# EAGLE design main_v3 (EAGLE 8.5.1)

## Sheet 1 of 5: Main Control ICs
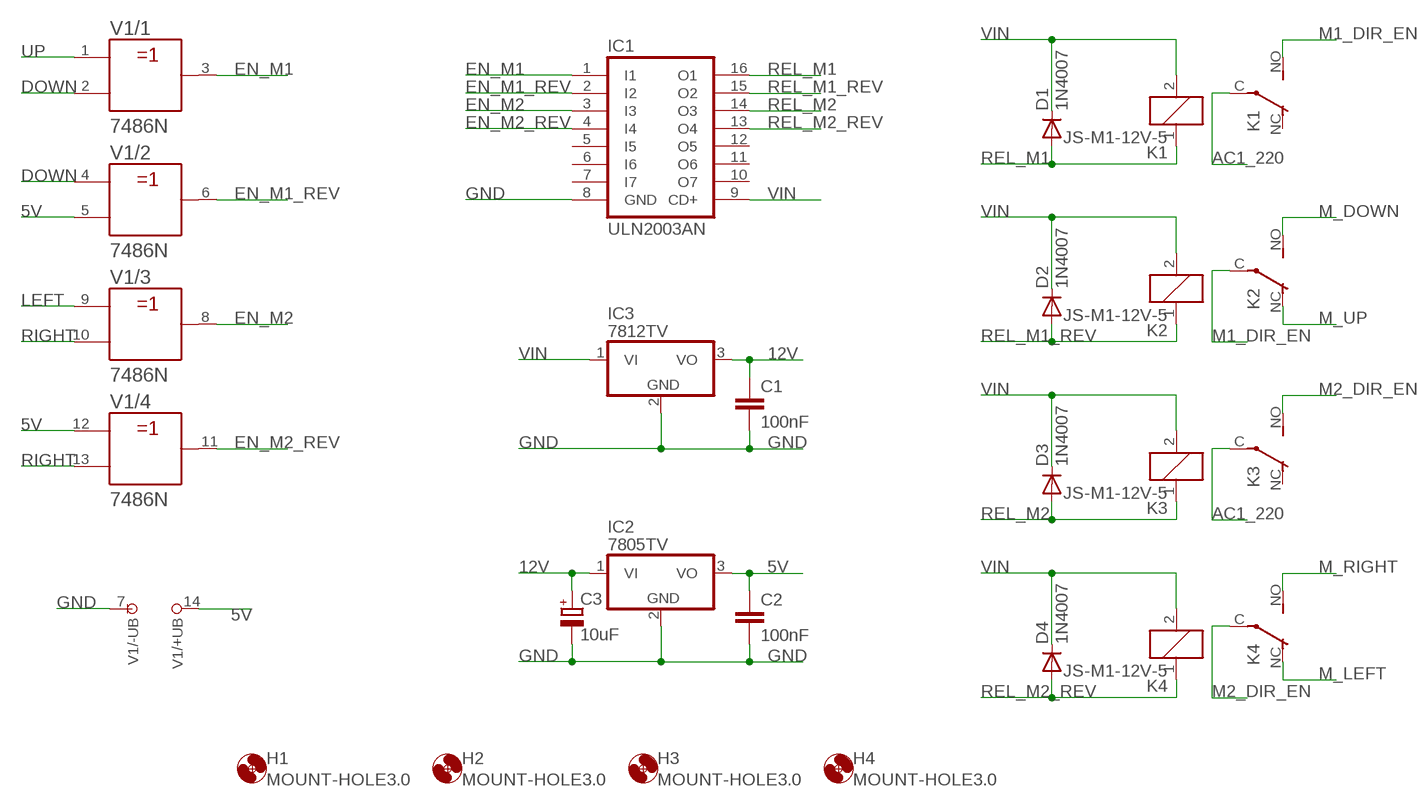
[diagram p0: schematic, sheet 1]

### Parts
C1  100nF  C-EU050-025X075  [C050-025X075]
C2  100nF  C-EU050-025X075  [C050-025X075]
C3  10uF  CPOL-EUE3.5-8  [E3,5-8]
D1  1N4007  1N4004  [DO41-10]
D2  1N4007  1N4004  [DO41-10]
D3  1N4007  1N4004  [DO41-10]
D4  1N4007  1N4004  [DO41-10]
H1  MOUNT-HOLE3.0  [3,0]
H2  MOUNT-HOLE3.0  [3,0]
H3  MOUNT-HOLE3.0  [3,0]
H4  MOUNT-HOLE3.0  [3,0]
IC1  ULN2003AN  [DIL16]
IC2  7805TV  [TO220V]
IC3  7812TV  [TO220V]
K1  JS-M1-12V-5  [JS-M]
K2  JS-M1-12V-5  [JS-M]
K3  JS-M1-12V-5  [JS-M]
K4  JS-M1-12V-5  [JS-M]
V1  7486N  [DIL14]

### Nets
5V: C2.1 IC2.3(VO) V1.5(/2:B) V1.12(/4:A) V1.14(/+UB:+UB) ; also sheet 2
12V: C1.1 C3.+ IC2.1(VI) IC3.3(VO)
AC1_220: K1.C(2:P) K3.C(2:P) ; also sheet 3
DOWN: V1.2(/1:B) V1.4(/2:A) ; also sheet 2
EN_M1: IC1.1(I1) V1.3(/1:Y)
EN_M1_REV: IC1.2(I2) V1.6(/2:Y)
EN_M2: IC1.3(I3) V1.8(/3:Y)
EN_M2_REV: IC1.4(I4) V1.11(/4:Y)
GND: C1.2 C2.2 C3.- IC1.8(GND) IC2.2(GND) IC3.2(GND) V1.7(/-UB:-UB) ; also sheet 2,4
LEFT: V1.9(/3:A) ; also sheet 2
M1_DIR_EN: K1.NO(2:S) K2.C(2:P)
M2_DIR_EN: K3.NO(2:S) K4.C(2:P)
M_DOWN: K2.NO(2:S) ; also sheet 3
M_LEFT: K4.NC(2:O) ; also sheet 3
M_RIGHT: K4.NO(2:S) ; also sheet 3
M_UP: K2.NC(2:O) ; also sheet 3
REL_M1: D1.A IC1.16(O1) K1.1 ; also sheet 5
REL_M1_REV: D2.A IC1.15(O2) K2.1 ; also sheet 5
REL_M2: D3.A IC1.14(O3) K3.1 ; also sheet 5
REL_M2_REV: D4.A IC1.13(O4) K4.1 ; also sheet 5
RIGHT: V1.10(/3:B) V1.13(/4:B) ; also sheet 2
UP: V1.1(/1:A) ; also sheet 2
VIN: D1.C D2.C D3.C D4.C IC1.9(CD+) IC3.1(VI) K1.2 K2.2 K3.2 K4.2 ; also sheet 2,4,5
Unconnected: IC1.5(I5) IC1.6(I6) IC1.7(I7) IC1.10(O7) IC1.11(O6) IC1.12(O5) K1.NC(2:O) K3.NC(2:O)

## Sheet 2 of 5: Inputs
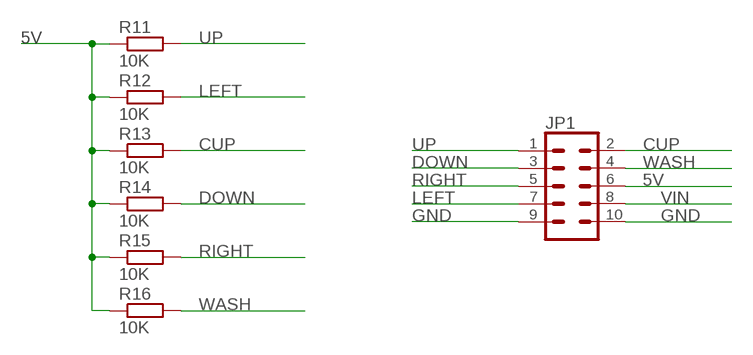
[diagram p1: schematic, sheet 2]

### Parts
JP1  CONN_05X2PTH  [2X5]
R11  10K  R-EU_0207/10  [0207/10]
R12  10K  R-EU_0207/10  [0207/10]
R13  10K  R-EU_0207/10  [0207/10]
R14  10K  R-EU_0207/10  [0207/10]
R15  10K  R-EU_0207/10  [0207/10]
R16  10K  R-EU_0207/10  [0207/10]

### Nets
5V: JP1.6 R11.1 R12.1 R13.1 R14.1 R15.1 R16.1 ; also sheet 1
CUP: JP1.2 R13.2
DOWN: JP1.3 R14.2 ; also sheet 1
GND: JP1.9 JP1.10 ; also sheet 1,4
LEFT: JP1.7 R12.2 ; also sheet 1
RIGHT: JP1.5 R15.2 ; also sheet 1
UP: JP1.1 R11.2 ; also sheet 1
VIN: JP1.8 ; also sheet 1,4,5
WASH: JP1.4 R16.2

## Sheet 3 of 5: Terminals
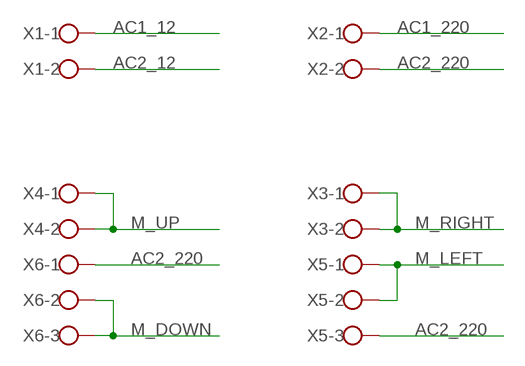
[diagram p2: schematic, sheet 3]

### Parts
X1  W237-102  [W237-102]
X2  W237-102  [W237-102]
X3  W237-102  [W237-102]
X4  W237-102  [W237-102]
X5  W237-103  [W237-103]
X6  W237-103  [W237-103]

### Nets
AC1_12: X1.1 ; also sheet 4
AC1_220: X2.1 ; also sheet 1
AC2_12: X1.2 ; also sheet 4
AC2_220: X2.2 X5.3 X6.1
M_DOWN: X6.2 X6.3 ; also sheet 1
M_LEFT: X5.1 X5.2 ; also sheet 1
M_RIGHT: X3.1 X3.2 ; also sheet 1
M_UP: X4.1 X4.2 ; also sheet 1

## Sheet 4 of 5: Bridge Rectifir
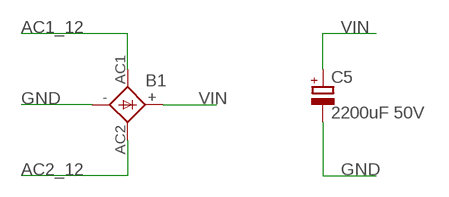
[diagram p3: schematic, sheet 4]

### Parts
B1  GBPC6  [GBPC6]
C5  2200uF 50V  CPOL-EUE7.5-18  [E7,5-18]

### Nets
AC1_12: B1.AC1 ; also sheet 3
AC2_12: B1.AC2 ; also sheet 3
GND: B1.- C5.- ; also sheet 1,2
VIN: B1.+ C5.+ ; also sheet 1,2,5

## Sheet 5 of 5: Indicators
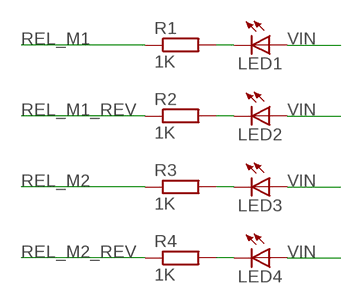
[diagram p4: schematic, sheet 5]

### Parts
LED1  LED5MM  [LED5MM]
LED2  LED5MM  [LED5MM]
LED3  LED5MM  [LED5MM]
LED4  LED5MM  [LED5MM]
R1  1K  R-EU_0207/10  [0207/10]
R2  1K  R-EU_0207/10  [0207/10]
R3  1K  R-EU_0207/10  [0207/10]
R4  1K  R-EU_0207/10  [0207/10]

### Nets
N$1: LED1.K(C) R1.2
N$2: LED2.K(C) R2.2
N$3: LED3.K(C) R3.2
N$4: LED4.K(C) R4.2
REL_M1: R1.1 ; also sheet 1
REL_M1_REV: R2.1 ; also sheet 1
REL_M2: R3.1 ; also sheet 1
REL_M2_REV: R4.1 ; also sheet 1
VIN: LED1.A LED2.A LED3.A LED4.A ; also sheet 1,2,4

## Library data of the parts
B1 = rectifier:GBPC6: GENERAL INSTRUMENT RECTIFIER
C1 C2 = rcl:C-EU: CAPACITOR, European symbol; SPICEPREFIX: C
C3 = rcl:CPOL-EU: POLARIZED CAPACITOR, European symbol; SPICEPREFIX: C
C5 = rcl:CPOL-EU: POLARIZED CAPACITOR, European symbol
D1-D4 = adafruit:1N4004: DIODE General purpose 1N400x type rectifier (With bigger pads) http://www.ladyada.net/library/pcb/eaglelibrary.html
H1-H4 = holes:MOUNT-HOLE: MOUNTING HOLE with drill center marker
IC1 = uln-udn:ULN2003A: DRIVER ARRAY
IC2 IC3 = linear:78*: Positive VOLTAGE REGULATOR Source: http://cache.national.com/ds/LM/LM78L05.pdf http://www.fairchildsemi.com/ds/LM/LM7805.pdf
JP1 = SparkFun-Connectors:CONN_05X2: Multi connection point. Often used as Generic Header-pin footprint for 0.1 inch spaced/style header connections For AVR SPI programming port, see special device with nice symbol: "AVR_SPI_PROG_5x2.dev" You can populate with any combo of single row headers, but if you'd like an exact match, check these: 2x5 AVR ICSP Male Header <https://www.sparkfun.com/products/778> (PRT-00778) 2x5 Pin Shrouded Header <https://www.sparkfun.com/products/8506> (PRT-08506) On any of the 0.1 inch spaced packages, you can populate with these: Break Away Headers - Straight <https://www.sparkfun.com/products/116> (PRT-00116) Break Away Male Headers - Right Angle <https://www.sparkfun.com/products/553> (PRT-00553) Female Headers <https://www.sparkfun.com/products/115> (PRT-00115) Break Away Headers - Machine Pin <https://www.sparkfun.com/products/117> (PRT-00117) Break Away Female Headers - Swiss Machine Pin <https://www.sparkfun.com/products/743> (PRT-00743) Special note: the shrouded connector mates well with our 5x2 ribbon cables: 2x5 Pin IDC Ribbon Cable <https://www.sparkfun.com/products/8535> (PRT-08535); PROD_ID: CONN-08499; SF_ID: PRT-0778
K1-K4 = relay:JS-M1*: Automotive Ultra-Miniature Power Relay NAiS Source: http://www.mew-europe.com/.. en_ds_61211_0000.pdf; MF: FARNELL; MPN: JSM1-12V-5; OC_FARNELL: 910351; OC_NEWARK: 14J1764
LED1-LED4 = adafruit:LED: LED OSRAM: - CHIPLED LG R971, LG N971, LY N971, LG Q971, LY Q971, LO R971, LY R971 LH N974, LH R974 LS Q976, LO Q976, LY Q976 LO Q996 - Hyper CHIPLED LW Q18S LB Q993, LB Q99A, LB R99A - SideLED LS A670, LO A670, LY A670, LG A670, LP A670 LB A673, LV A673, LT A673, LW A673 LH A674 LY A675 LS A676, LA A676, LO A676, LY A676, LW A676 LS A679, LY A679, LG A679 - Hyper Micro SIDELED® LS Y876, LA Y876, LO Y876, LY Y876 LT Y87S - SmartLED LW L88C, LW L88S LB L89C, LB L89S, LG L890 LS L89K, LO L89K, LY L89K LS L896, LA L896, LO L896, LY L896 - TOPLED LS T670, LO T670, LY T670, LG T670, LP T670 LSG T670, LSP T670, LSY T670, LOP T670, LYG T670 LG T671, LOG T671, LSG T671 LB T673, LV T673, LT T673, LW T673 LH T674 LS T676, LA T676, LO T676, LY T676, LB T676, LH T676, LSB T676, LW T676 LB T67C, LV T67C, LT T67C, LS T67K, LO T67K, LY T67K, LW E67C LS E67B, LA E67B, LO E67B, LY E67B, LB E67C, LV E67C, LT E67C LW T67C LS T679, LY T679, LG T679 LS T770, LO T770, LY T770, LG T770, LP T770 LB T773, LV T773, LT T773, LW T773 LH T774 LS E675, LA E675, LY E675, LS T675 LS T776, LA T776, LO T776, LY T776, LB T776 LHGB T686 LT T68C, LB T68C - Hyper Mini TOPLED® LB M676 - Mini TOPLED Santana® LG M470 LS M47K, LO M47K, LY M47K Source: http://www.osram.convergy.de/
R1-R4 R11-R16 = rcl:R-EU_: RESISTOR, European symbol; SPICEPREFIX: R
V1 = 74ttl-din:74*86: Quad 2-input EXCLUSIV-OR gate
X1-X4 = con-wago-500:W237-102: WAGO SCREW CLAMP
X5 X6 = con-wago-500:W237-103: WAGO SCREW CLAMP

## Board
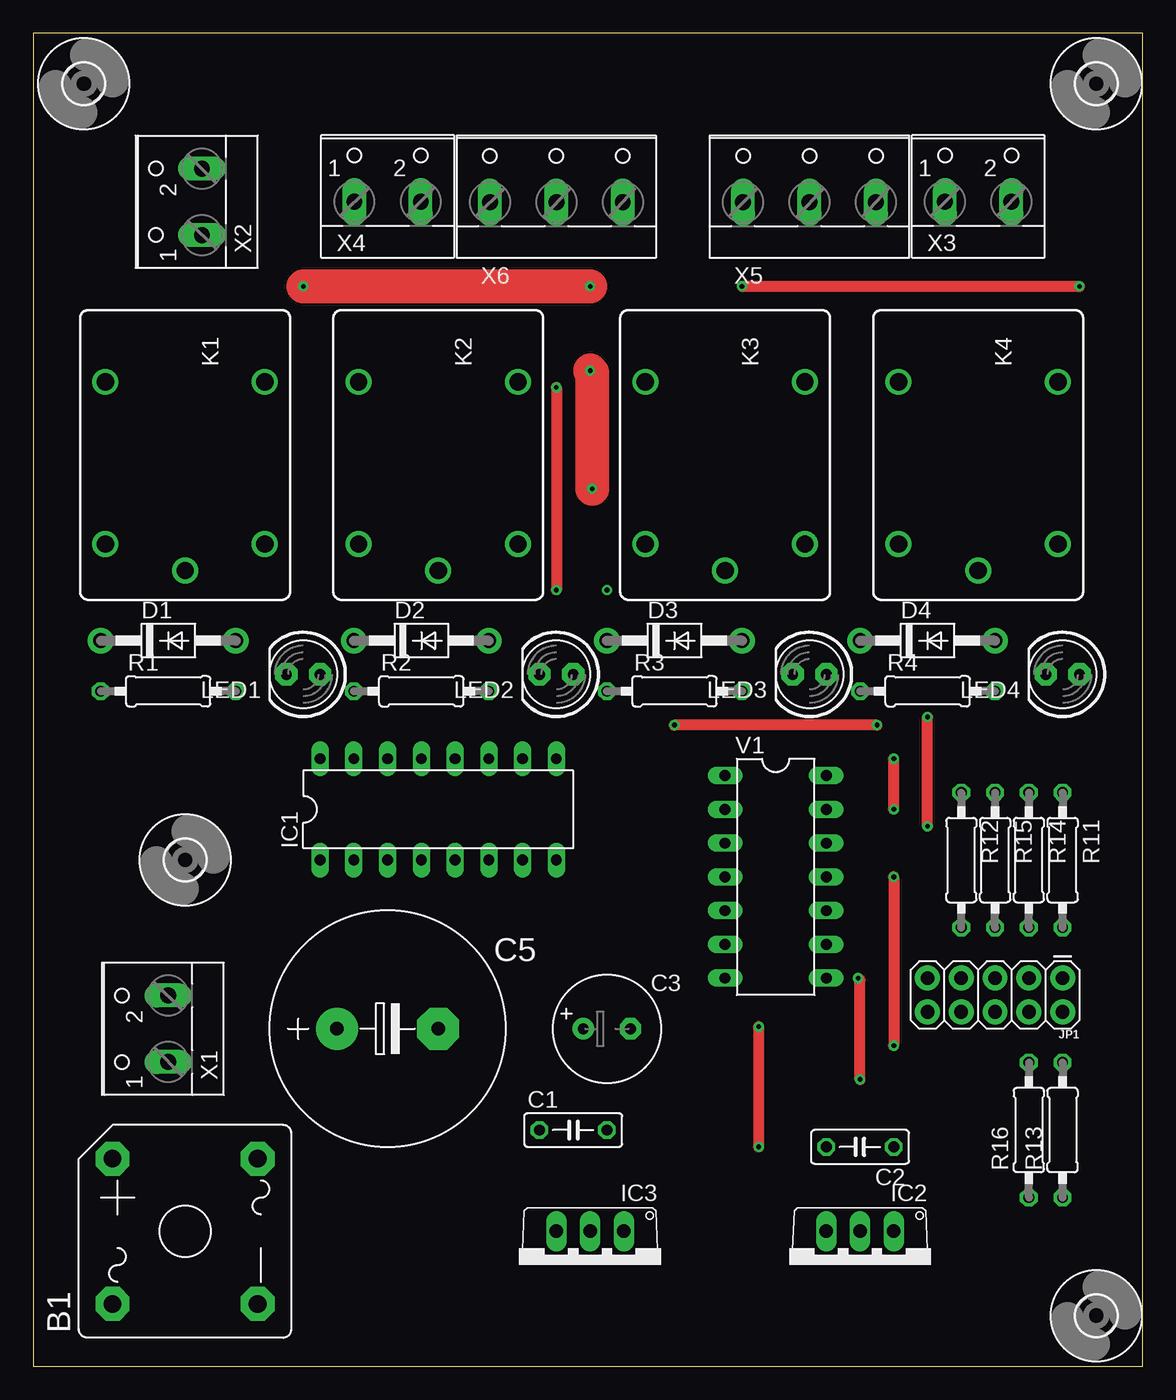
[diagram p5: board, top side]
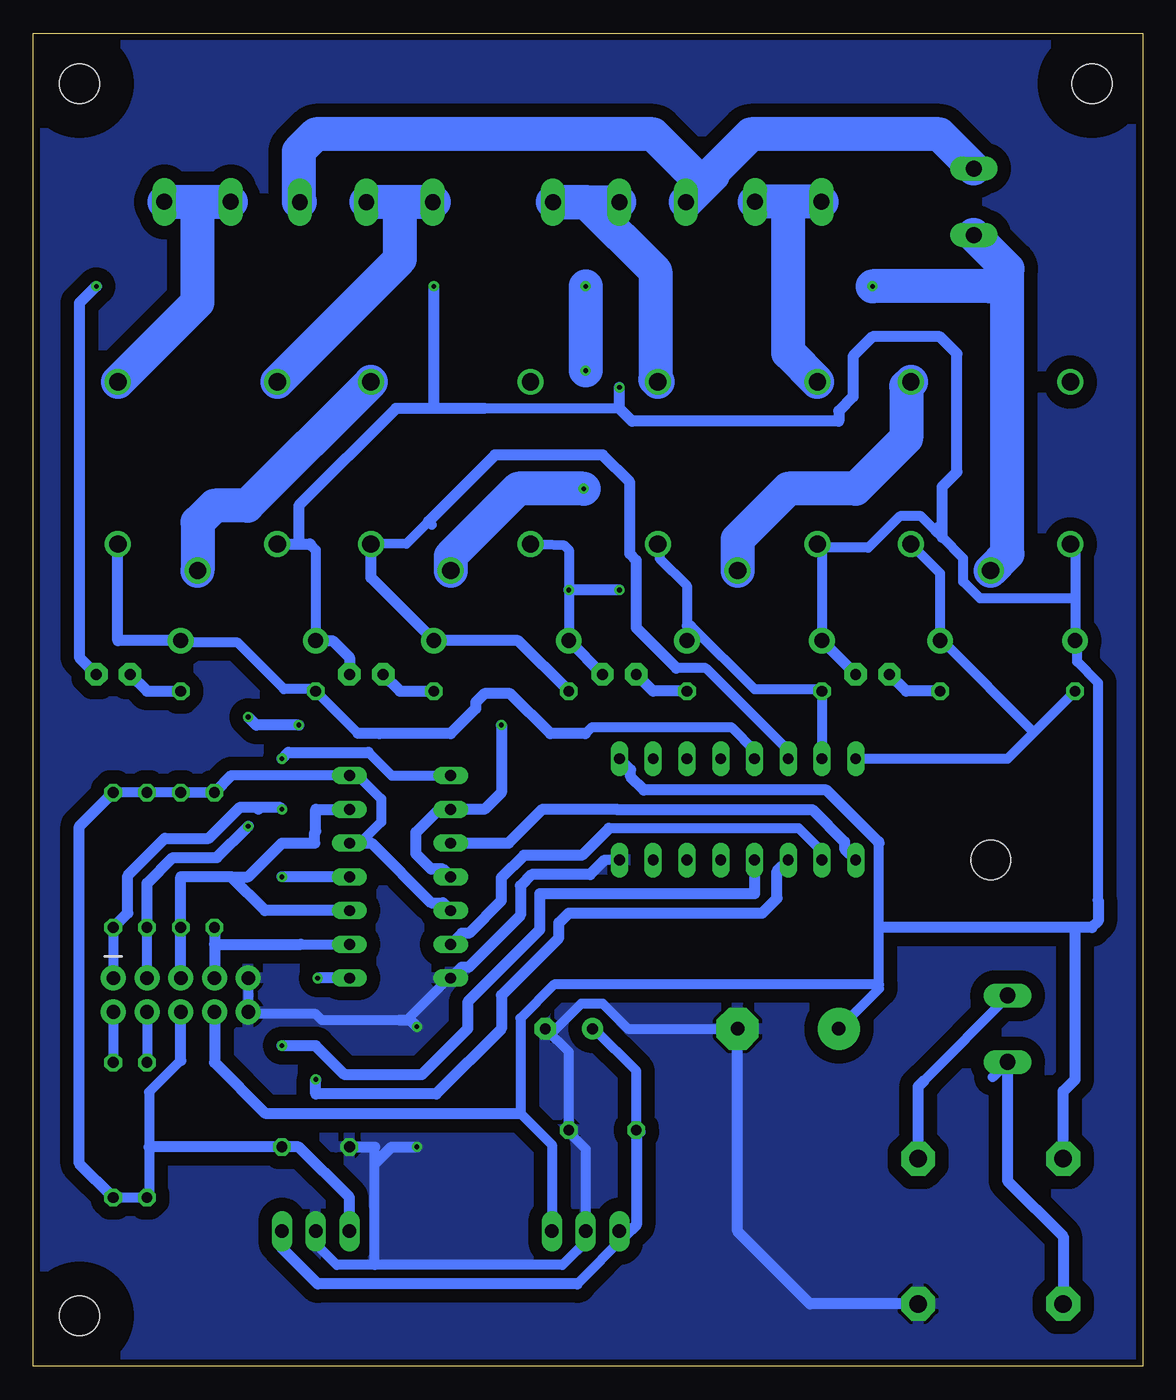
[diagram p6: board, bottom side, seen from below]

Size 83.49 x 100.32 mm. Coordinates in mm from the lower left corner, seen from the top.
Outline: 0,0 83.49,0 83.49,100.32 0,100.32 0,0
Copper layers (1*16): Top 0.035mm / dielectric 1.5mm / Bottom 0.035mm
Design rules "default *": minimum track width 30mil, minimum drill 0.35mm, track to track 40mil, track to pad 40mil, pad to pad 6mil, via to via 6mil, smd to smd 6mil, copper to edge 20mil, drill to drill 6mil, minimum pad ring 10mil, minimum via ring 8mil, stop-mask expansion 4mil, vias tented up to drill 0mil, thermal gap 10mil

### Footprints (pad centres in the part's own frame; a part is rotated, then mirrored left to right if it is on the bottom)
GBPC6 = drill 1.321 pad 2.54 octagon: + 5.461,5.461; - -5.461,-5.461; AC1 -5.461,5.461; AC2 5.461,-5.461
C050-025X075 = drill 0.813 octagon: 1 -2.54,0; 2 2.54,0
E3,5-8 = drill 0.813 pad 1.6: + -1.778,0 | drill 0.813 pad 1.6 octagon: - 1.778,0
E7,5-18 = drill 1.016 pad 3.15: + -3.81,0 | drill 1.016 pad 3.15 octagon: - 3.81,0
DO41-10 = drill 1.118 pad 1.93: A 5.08,0; C -5.08,0
3,0 = hole 3: 0,0
DIL16 = drill 0.813 long: 1 -8.89,-3.81; 2 -6.35,-3.81; 3 -3.81,-3.81; 4 -1.27,-3.81; 5 1.27,-3.81; 6 3.81,-3.81; 7 6.35,-3.81; 8 8.89,-3.81; 9 8.89,3.81; 10 6.35,3.81; 11 3.81,3.81; 12 1.27,3.81; 13 -1.27,3.81; 14 -3.81,3.81; 15 -6.35,3.81; 16 -8.89,3.81
TO220V = drill 1.016 long: 1 -2.54,-2.54; 2 0,-2.54; 3 2.54,-2.54
2X5 = drill 1.016 pad 1.88: 1 0,0; 2 0,2.54; 3 2.54,0; 4 2.54,2.54; 5 5.08,0; 6 5.08,2.54; 7 7.62,0; 8 7.62,2.54; 9 10.16,0; 10 10.16,2.54
JS-M = drill 1.3: 1 6.7,6; 2 6.7,-6; C 8.7,0; NC -5.5,-6; NO -5.5,6
LED5MM = drill 0.813 pad 1.676 octagon: A -1.27,0; K 1.27,0
0207/10 = drill 0.813 octagon: 1 -5.08,0; 2 5.08,0
DIL14 = drill 0.813 long: 1 -7.62,-3.81; 2 -5.08,-3.81; 3 -2.54,-3.81; 4 0,-3.81; 5 2.54,-3.81; 6 5.08,-3.81; 7 7.62,-3.81; 8 7.62,3.81; 9 5.08,3.81; 10 2.54,3.81; 11 0,3.81; 12 -2.54,3.81; 13 -5.08,3.81; 14 -7.62,3.81
W237-102 = drill 1.194 long: 1 -2.5,-1.27; 2 2.5,-1.27
W237-103 = drill 1.194 long: 1 -5,-1.29; 2 0,-1.29; 3 5,-1.29

### Placement (x,y rotation side)
B1  11.43,10.16 90 top
C1  40.64,17.78 0 top
C2  62.23,16.51 180 top
C3  43.18,25.4 0 top
C5  26.67,25.4 0 top
D1  10.16,54.61 0 top
D2  29.21,54.61 0 top
D3  48.26,54.61 0 top
D4  67.31,54.61 0 top
H1  80.01,3.81 0 top
H2  80.01,96.52 0 top
H3  11.43,38.1 0 top
H4  3.81,96.52 0 top
IC1  30.48,41.91 0 top
IC2  62.23,7.62 180 top
IC3  41.91,7.62 180 top
JP1  77.47,29.21 180 top
K1  11.43,68.58 270 top
K2  30.48,68.58 270 top
K3  52.07,68.58 270 top
K4  71.12,68.58 270 top
LED1  20.32,52.07 180 top
LED2  39.37,52.07 180 top
LED3  58.42,52.07 180 top
LED4  77.47,52.07 180 top
R1  10.16,50.8 0 top
R2  29.21,50.8 0 top
R3  48.26,50.8 0 top
R4  67.31,50.8 0 top
R11  77.47,38.1 270 top
R12  69.85,38.1 270 top
R13  77.47,17.78 90 top
R14  74.93,38.1 270 top
R15  72.39,38.1 270 top
R16  74.93,17.78 90 top
V1  55.88,36.83 270 top
X1  8.89,25.4 90 top
X2  11.43,87.63 90 top
X3  71.12,88.9 0 top
X4  26.67,88.9 0 top
X5  58.42,88.9 0 top
X6  39.37,88.9 0 top

### Tracks (layer width: path | path; a pad name or v marks a point on that pad's centre or on a via)
5V
  Bottom 0.762: 68.58,44.45 V1.14 59.37,44.29 58.9,44.29 57.31,42.7 57.31,40.96 58.74,39.53 V1.12 | R15.1 R12.1 R14.1 R11.1 | R13.1 R16.1 74.77,13.02 74.77,16.51 74.77,20.64 72.39,23.02 | 51.44,34.29 V1.5
  Bottom 0.813: 68.58,44.45 R12.1 | R13.1 80.01,15.24 80.01,40.64 R11.1 | V1.5 52.65,34.87 53.54,34.87 58.04,39.37 V1.12 | IC2.3 59.69,12.7 63.5,16.51 C2.1 74.77,16.51 | 72.39,23.02 JP1.6
12V
  Bottom 0.762: C3.+ 41.27,25.4 38.1,22.22 C1.1 37.78,17.62 | 42.55,6.19 38.97,9.76 38.89,9.84 IC3.3
  Bottom 0.813: 42.55,6.19 62.07,6.19 64.77,8.89 IC2.1 | C1.1 38.1,10.64 38.97,9.76
AC1_12
  Bottom 0.762: 11.27,21.75 10.16,22.86 X1.1
  Bottom 0.813: X1.1 10.16,13.97 5.97,9.78 B1.AC1
AC1_220  (via drill 0.35)
  Top 2.54: v20.32,81.28 v41.91,81.28 | v41.91,74.93 42.06,74.77 v42.06,66.04
  Bottom 2.54: K1.C 10.16,61.15 10.16,82.59 | 10.16,82.59 X2.1 | 10.16,82.59 11.47,81.28 v20.32,81.28 | v41.91,81.28 v41.91,74.93 | v42.06,66.04 46.99,66.04 52.07,60.96 K3.C
AC2_12
  Bottom 0.762: 16.43,21.51 10.16,27.78 X1.2
  Bottom 0.813: B1.AC2 16.89,21.05 16.43,21.51
AC2_220
  Bottom 2.54: X2.2 15.28,92.71 29.48,92.71 32.35,89.84 32.35,89.63 33.05,88.93 | 33.05,88.93 X6.1 | 33.05,88.93 36.83,92.71 62.23,92.71 63.5,91.44 63.5,87.63 63.48,87.61 X5.3
CUP
  Bottom 0.762: JP1.2 R13.2
DOWN  (via drill 0.35)
  Top 0.813: v67.31,40.64 v67.31,48.86 | v63.5,48.26 v48.26,48.26
  Bottom 0.762: V1.2 51.44,41.91 | JP1.3 R14.2
  Bottom 0.813: v63.5,48.26 66.71,48.26 v67.31,48.86 | R14.2 74.93,36.34 72.99,38.28 69.67,38.28 v67.31,40.64 | v48.26,48.26 48.26,43.18 49.53,41.91 V1.2 52.96,41.91 54.69,40.18 54.69,38.56 53.54,37.41 52.65,37.41 V1.4
EN_M1
  Bottom 0.813: V1.3 47.7,39.37 45.14,41.93 39.56,41.93 39.54,41.9 24.87,41.9 22.43,39.47 22.43,38.94 IC1.1
EN_M1_REV
  Bottom 0.762: 40.16,40.48 25.88,40.48 24.13,38.74 IC1.2
  Bottom 0.813: V1.6 51.23,32.59 50.7,32.59 48.27,35.03 48.27,36.76 46.57,38.46 42.19,38.46 40.16,40.48
EN_M2  (via drill 0.35)
  Top 0.813: v62.23,21.59 62.23,29.06 v62.08,29.21
  Bottom 0.813: V1.8 v62.08,29.21 | IC1.3 27.51,37.26 27.51,35.21 28.61,34.11 43.18,34.11 43.92,33.37 43.92,32.24 48.25,27.91 48.25,25.41 53.16,20.5 62.23,20.5 v62.23,21.59
EN_M2_REV  (via drill 0.35)
  Top 0.813: v64.77,36.83 v64.77,24.13
  Bottom 0.813: V1.11 v64.77,36.83 | IC1.4 29.21,35.56 45.37,35.56 45.37,32.84 50.8,27.41 50.8,25.4 54.25,21.95 60.05,21.95 62.23,24.13 v64.77,24.13
GND  (via drill 0.35)
  Top 0.813: v54.61,16.51 v54.61,25.55
  Bottom 0.762: JP1.9 JP1.10 66.99,26.51 62.23,26.51 61.75,26.04 55.88,26.04 55.4,26.04 52.39,29.05 V1.7 | IC1.8 40.48,38.1 | C5.- 38.73,25.4 40.64,27.3 42.23,27.3 44.29,25.24 C3.- 44.93,25.4 43.18,23.65 C1.2 43.02,17.46 41.91,16.35 IC3.2 42.07,9.84 42.07,9.21 43.66,7.62 57.78,7.62 | 62.07,9.05 60.64,7.62 57.78,7.62 | 57.78,7.62 57.78,15.24 57.78,16.51
  Bottom 0.813: V1.7 51.23,30.05 50.7,30.05 46.82,33.93 46.82,36.16 45.97,37.01 41.57,37.01 40.48,38.1 | IC2.2 62.07,10 62.07,9.05 | C2.2 57.78,16.51 | 57.78,15.24 56.52,16.51 v54.61,16.51 | v54.61,25.55 55.09,26.04 55.88,26.04 | B1.- 25.02,4.7 30.48,10.16 C5.-
  pour Bottom: 0,100.33 83.82,100.33 83.82,0 0,0
LEFT
  Bottom 0.762: 63.34,31.75 V1.9
  Bottom 0.813: R12.2 69.85,31.75 | 69.85,31.75 JP1.7 | 69.85,31.75 63.34,31.75
M1_DIR_EN
  Bottom 0.762: 30.48,60.96 K2.C | 17.46,73.98 K1.NO
  Bottom 2.54: K1.NO 17.78,73.73 17.78,69.85 21.59,66.04 26.67,66.04 30.48,62.23 K2.C
M2_DIR_EN
  Bottom 2.54: K3.NO 67.38,64.77 69.85,64.77 71.12,63.5 K4.C
M_DOWN
  Bottom 2.54: K2.NO 36.68,74.28 36.68,82.4 41.91,87.63 44.35,87.63 | 44.35,87.63 X6.3 | 44.35,87.63 44.33,87.61 X6.2
M_LEFT
  Bottom 0.813: 58.4,87.63 55.88,87.63 53.4,87.63 | 53.34,87.63 53.4,87.63 | 53.4,87.63 X5.1
  Bottom 2.54: K4.NC 55.88,83.32 55.88,87.63 | X5.2 58.4,87.63 53.34,87.63
M_RIGHT
  Bottom 0.762: X3.2 71.12,87.63 X3.1
  Bottom 2.54: K4.NO 71.12,80.08 71.12,87.63 | X3.2 X3.1
M_UP
  Bottom 2.54: X4.1 26.67,87.63 | 26.67,87.63 X4.2 29.21,87.63 | K2.NC 26.67,76.27 26.67,87.63
N$1
  Bottom 0.813: R1.2 17.78,50.8 LED1.K
N$2
  Bottom 0.813: R2.2 36.83,50.8 LED2.K
N$3
  Bottom 0.813: LED3.K 55.88,50.8 R3.2
N$4
  Bottom 0.813: LED4.K 74.93,50.8 R4.2
REL_M1
  Bottom 0.762: K1.1 15.24,59.69 D1.A 14.92,54.45 8.18,47.7 | IC1.16 10.16,45.72 8.18,47.7 | R1.1 8.18,47.7
REL_M1_REV
  Bottom 0.762: IC1.15 R2.1 24.45,50.96 29.21,50.96 33.97,55.72 34.29,55.72 | 34.29,55.72 34.29,58.74 36.35,60.8 36.35,61.75 K2.1 | 34.29,55.72 D2.A
REL_M2
  Bottom 0.762: IC1.14 26.67,46.36 32.86,52.55 35.08,52.55 | 53.74,63.58 55.4,61.91 K3.1 | 53.74,63.58 53.34,63.98 | 53.5,54.93 D3.A | 53.5,63.34 53.74,63.58
  Bottom 0.813: R3.1 46.99,54.61 D3.A 58.07,59.34 K3.1 | 35.08,52.55 38.1,55.56 38.1,60.65 38.59,61.14 38.59,66.53 40.64,68.58 48.74,68.58 53.74,63.58
REL_M2_REV
  Bottom 0.762: IC1.13 29.21,46.36 30.96,48.1 41.43,48.1 41.91,47.62 | 59.05,47.62 R4.1 62.55,50.96 64.61,50.96 68.1,54.45 72.07,54.45 D4.A
  Bottom 0.813: 41.91,47.62 41.93,47.62 41.95,47.61 44.57,47.61 47.59,50.62 49.53,50.62 50.19,49.96 50.19,49.5 52.08,47.61 57.43,47.61 57.45,47.62 59.05,47.62 | D4.A 77.12,54.61 K4.1
RIGHT
  Bottom 0.762: 60.33,34.29 V1.10 59.37,34.13 58.9,34.13 | 60.33,41.91 V1.13
  Bottom 0.813: JP1.5 R15.2 72.39,36.83 68.58,36.83 | V1.10 66.04,34.29 68.58,36.83 | 68.58,36.83 67.31,36.83 64.77,39.37 62.31,39.37 62.31,40.18 62.23,40.26 62.23,41.91 60.33,41.91
UP  (via drill 0.35)
  Top 0.813: v64.77,41.91 v64.77,45.72
  Bottom 0.762: V1.1 56.52,44.45 58.26,46.2 | R11.2 JP1.1
  Bottom 0.813: R11.2 76.38,34.11 76.38,36.94 73.59,39.73 70.27,39.73 67.91,42.09 66.71,42.09 | 66.71,42.09 66.53,41.91 | v64.77,45.72 64.29,46.2 58.26,46.2 | 66.71,42.09 64.95,42.09 v64.77,41.91
VIN  (via drill 0.35)
  Top 0.813: v39.37,73.66 v39.37,58.42 | v53.34,81.28 v78.74,81.28
  Bottom 0.762: D4.C 62.23,61.44 62.55,61.75 | D2.C 24.13,61.44 24.45,61.75 K2.2 23.81,61.6 20.64,61.6 18.26,63.98 16.67,63.98 15.64,62.94 | 5.08,57.79 5.08,61.44 5.4,61.75 K1.2 | 5.08,57.79 D1.C 4.92,54.29 4.92,53.02 3.33,51.44 3.33,35.08 | 39.37,45.09 IC1.9 | 19.84,28.73 19.84,28.42 C5.+ | 19.84,28.73 19.84,33.02 19.84,39.37 19.84,39.53 | IC3.1 44.45,16.67 46.83,19.05 46.83,26.19 44.29,28.73 19.84,28.73 | 15.64,62.94 15.08,62.39 13.49,60.8 13.49,59.05 12.22,57.79 5.08,57.79 | 39.37,72.07 49.53,72.07 50.32,72.07 | 15.4,63.18 15.64,62.94 | D3.C v43.18,58.42 43.18,61.44 43.5,61.75 K3.2 | 70.01,26.35 JP1.8
  Bottom 0.813: v39.37,73.66 39.37,72.07 38.42,71.12 22.86,71.12 22.86,71.89 21.79,72.96 21.79,76 20.32,77.47 15.24,77.47 13.97,76.2 13.97,67.31 15.08,66.2 15.08,62.39 | v39.37,58.42 v43.18,58.42 | 19.84,39.37 19.89,39.41 19.89,39.47 23.78,43.36 37.53,43.36 38.53,44.36 38.53,44.88 IC1.9 | K4.2 63.5,61.88 | 63.5,61.88 62.67,61.88 62.55,61.75 | 49.53,72.07 53.34,72.07 | 53.34,72.07 56.2,72.07 63.5,64.77 63.5,61.88 | 46.83,19.05 66.04,19.05 69.85,22.86 JP1.8 | 3.33,35.08 3.33,33.5 3.81,33.02 5.08,33.02 | 5.08,33.02 19.84,33.02 | B1.+ 5.97,20.7 5.08,21.59 5.08,33.02 | 53.34,72.07 v53.34,81.28 | v78.74,81.28 80.01,80.01 80.01,53.34 LED4.A | D4.C 60.96,54.61 59.69,53.34 LED3.A | D3.C LED2.A | LED1.A D2.C
WASH
  Bottom 0.762: JP1.4 R16.2